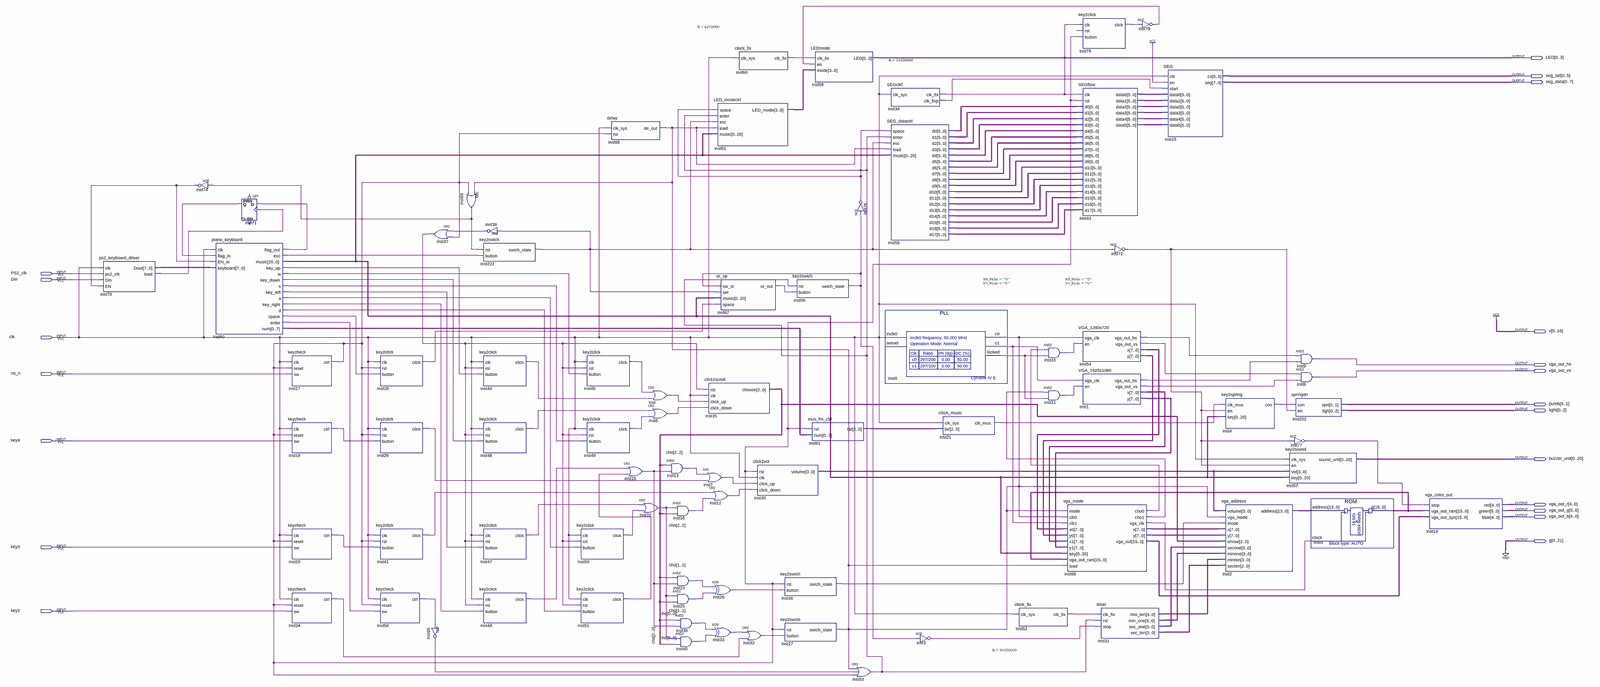
[diagram p0: schematic sheet, whole]
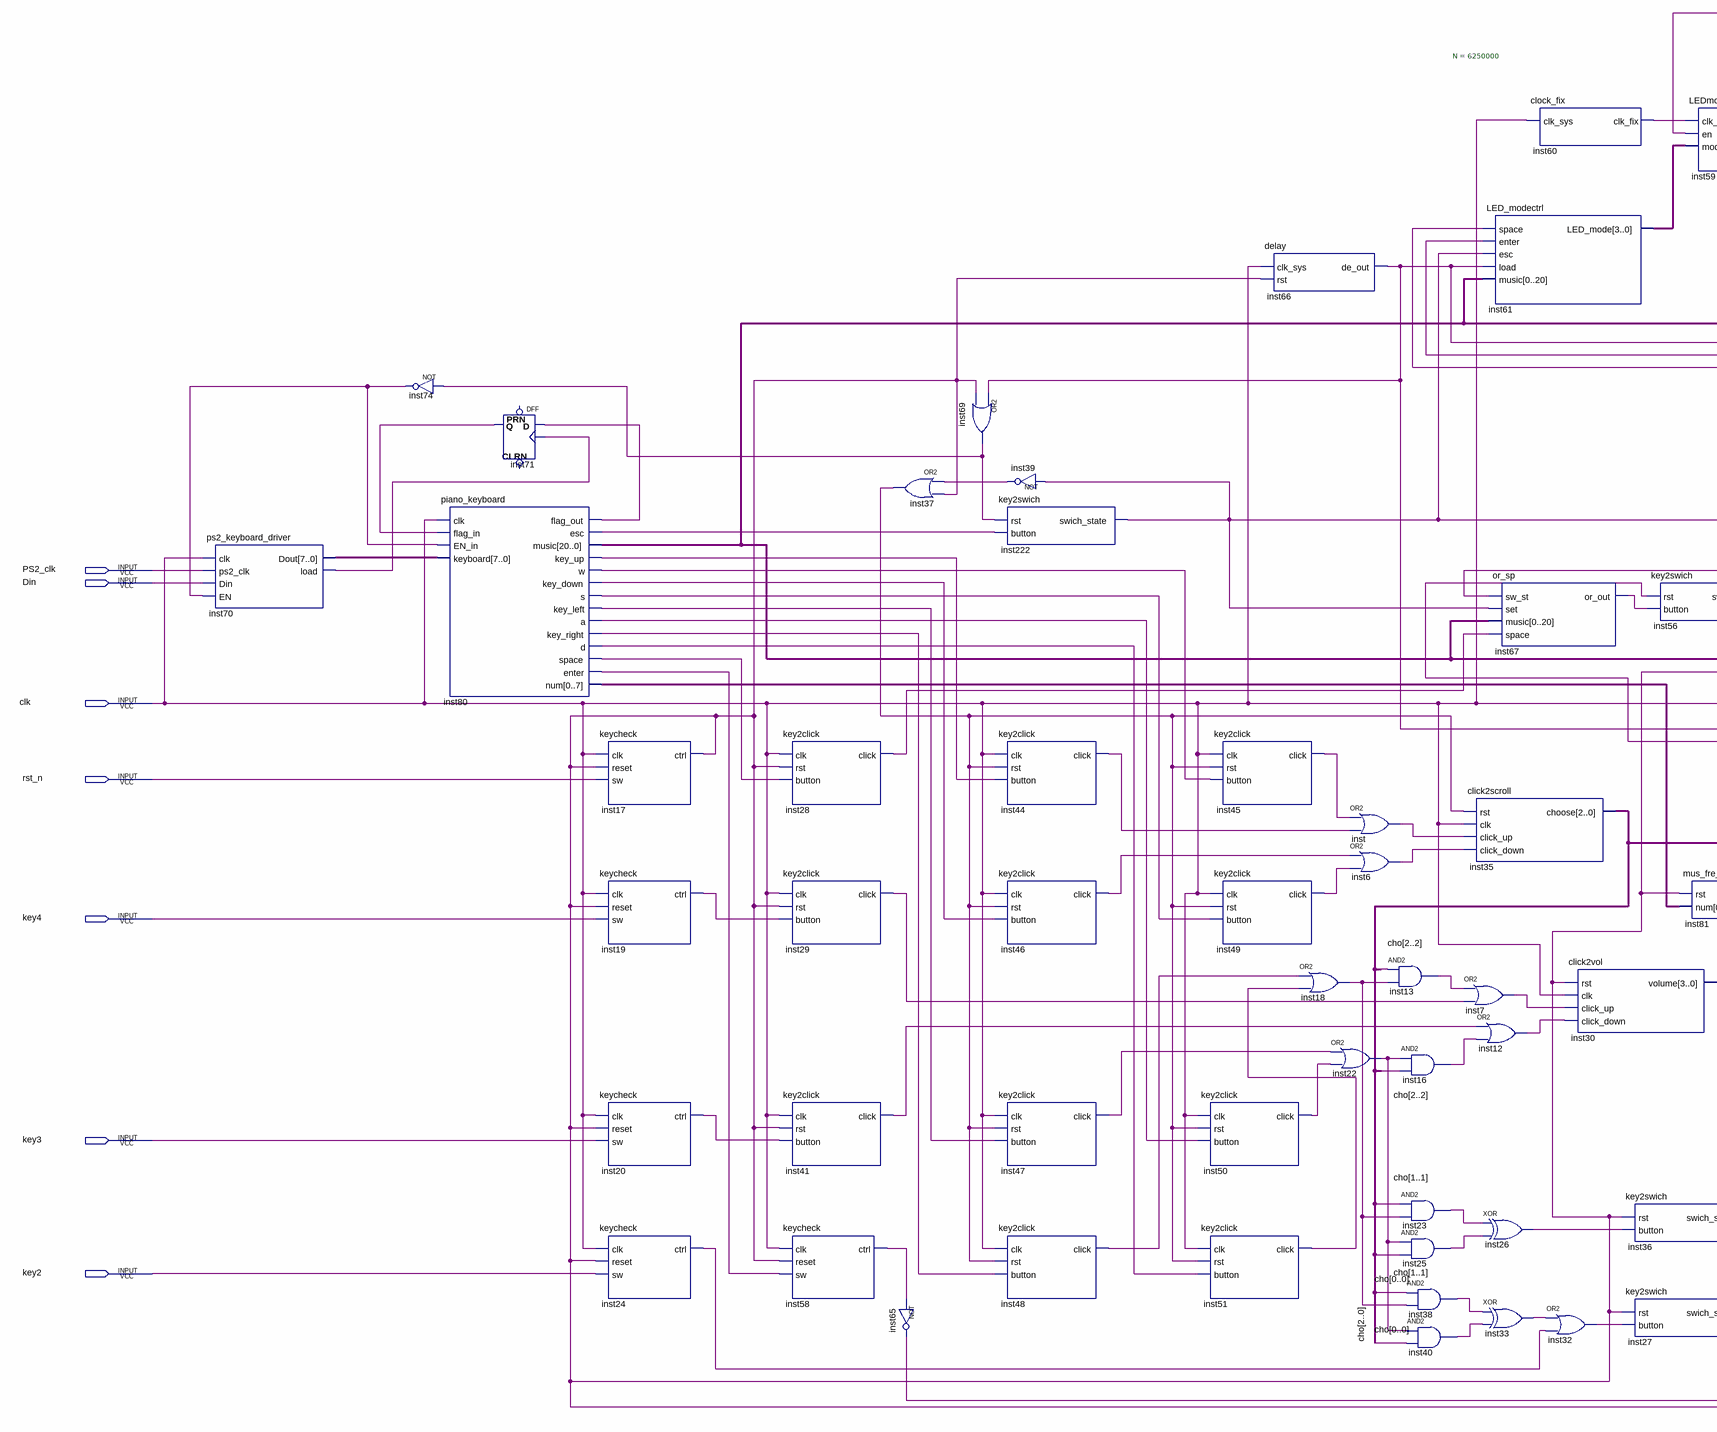
[diagram p1: schematic sheet, left part]
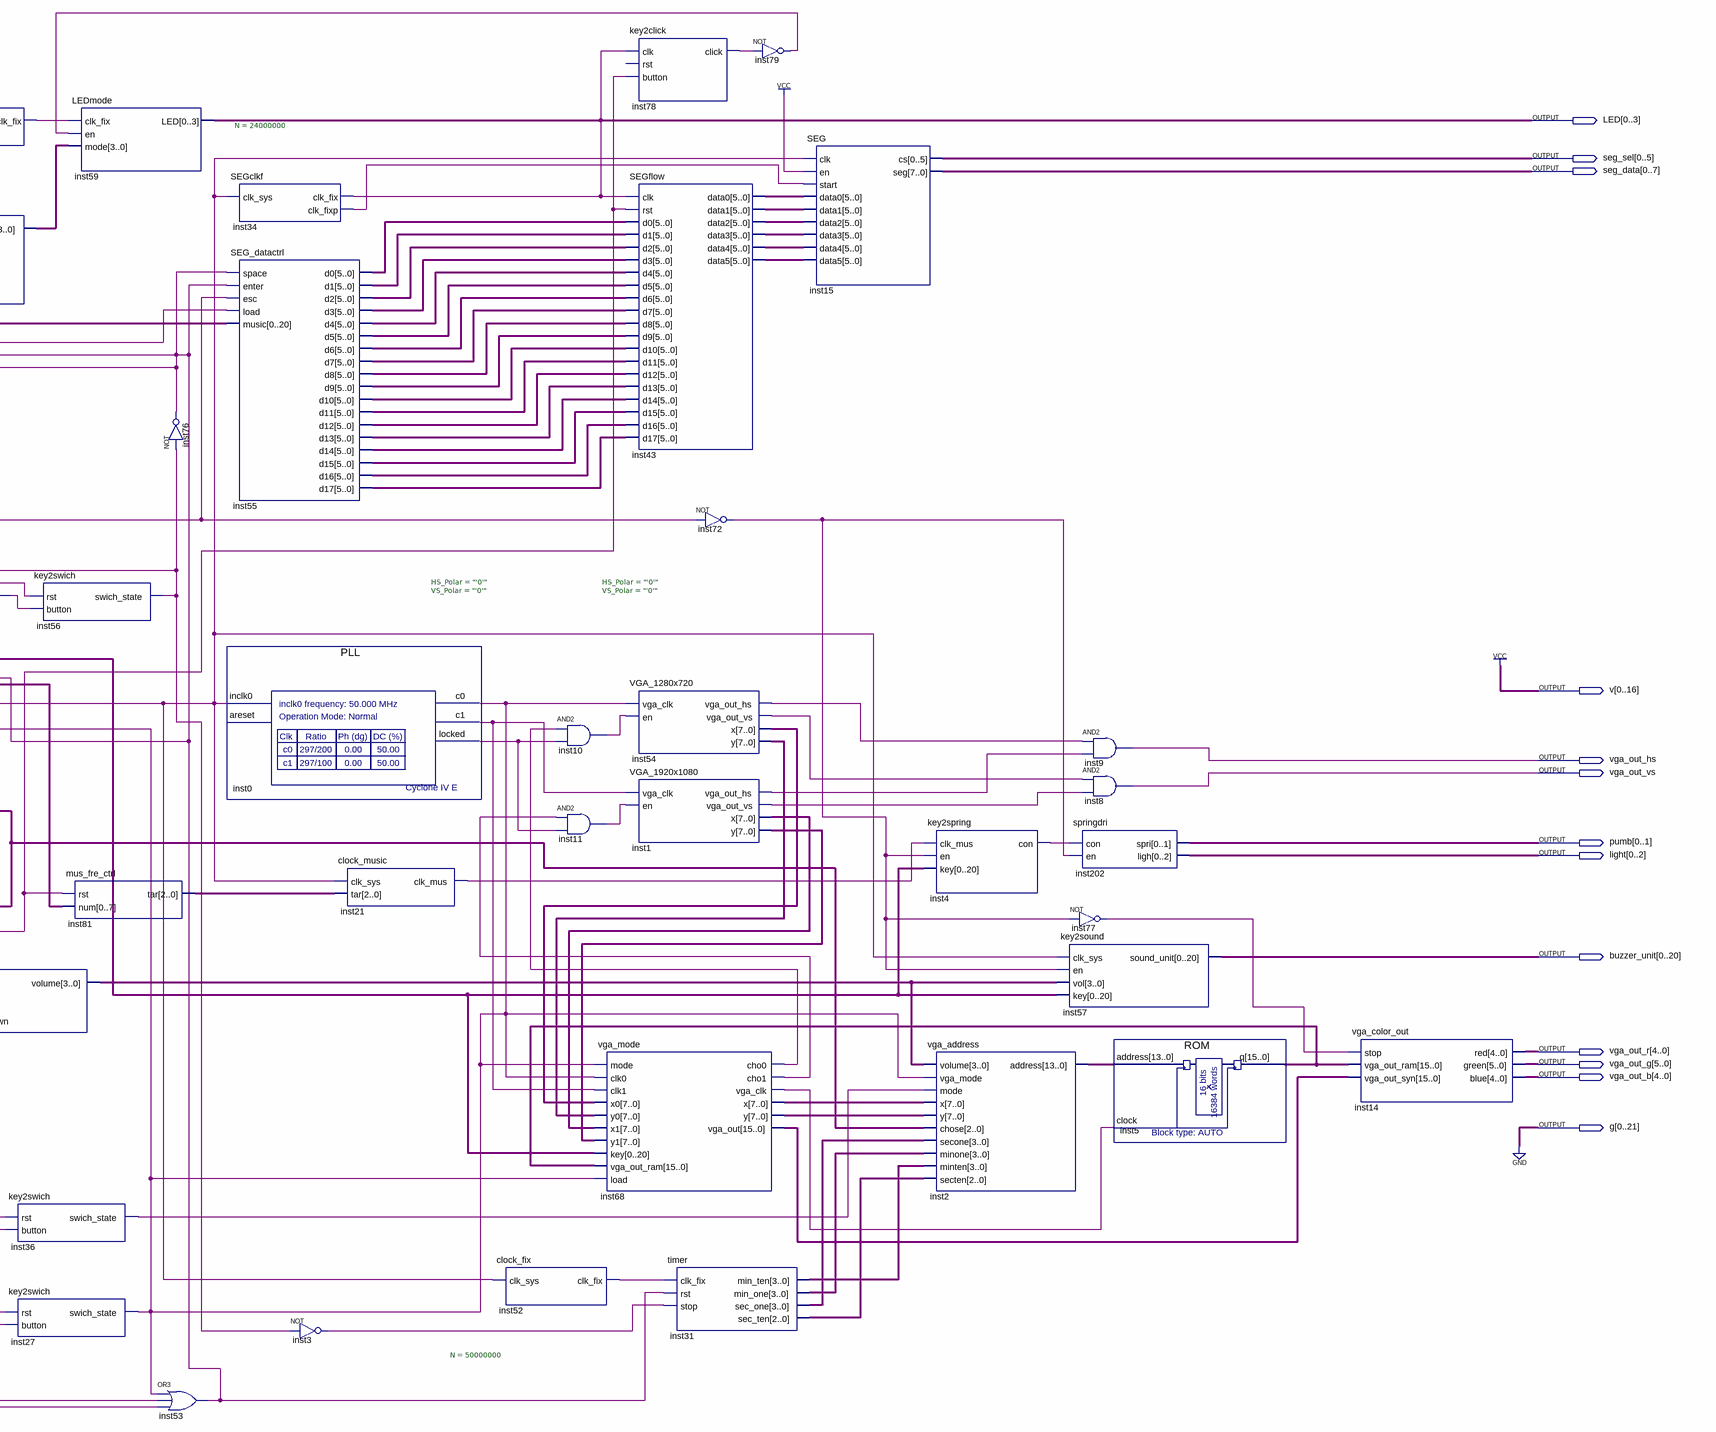
[diagram p2: schematic sheet, right part]
// Quartus schematic Eano.bdf as structural Verilog: 79 symbols, 20 pins
module Eano (
  input  PS2_clk,
  input  Din,
  input  clk,
  input  rst_n,
  input  key4,
  input  key3,
  input  key2,
  output [0:3] LED,
  output [0:5] seg_sel,
  output [0:7] seg_data,
  output [0:16] v,
  output vga_out_hs,
  output vga_out_vs,
  output [0:1] pumb,
  output [0:2] light,
  output [0:20] buzzer_unit,
  output [4:0] vga_out_r,
  output [5:0] vga_out_g,
  output [4:0] vga_out_b,
  output [0:21] g
);

  wire inst0_c1, inst0_locked, inst1_vga_out_hs, inst1_vga_out_vs, inst3_out, inst4_con, inst6_out,
       inst7_out, inst10_out, inst11_out, inst12_out, inst13_out, inst16_out, inst17_ctrl, inst18_out,
       inst19_ctrl, inst20_ctrl, inst21_clk_mus, inst22_out, inst23_out, inst24_ctrl, inst25_out, inst26_out,
       inst28_click, inst29_click, inst32_out, inst33_out, inst34_clk_fix, inst34_clk_fixp,
       inst36_swich_state, inst37_out, inst38_out, inst39_out, inst40_out, inst41_click, inst44_click,
       inst45_click, inst46_click, inst47_click, inst48_click, inst49_click, inst50_click, inst51_click,
       inst52_clk_fix, inst54_vga_out_hs, inst54_vga_out_vs, inst56_swich_state, inst58_ctrl, inst60_clk_fix,
       inst65_out, inst66_de_out, inst67_or_out, inst68_cho0, inst68_cho1, inst68_vga_clk, inst69_out,
       inst70_load, inst71_q, inst72_out, inst74_out, inst76_out, inst77_out, inst78_click, inst79_out,
       inst80_a, inst80_d, inst80_enter, inst80_esc, inst80_flag_out, inst80_key_down, inst80_key_left,
       inst80_key_right, inst80_key_up, inst80_s, inst80_space, inst80_w, inst222_swich_state, inst_out;
  wire [2:0] cho, inst31_sec_ten, inst81_tar;
  wire [3:0] inst30_volume, inst31_min_one, inst31_min_ten, inst31_sec_one, inst61_led_mode;
  wire [5:0] inst43_data0, inst43_data1, inst43_data2, inst43_data3, inst43_data4, inst43_data5, inst55_d0,
       inst55_d1, inst55_d2, inst55_d3, inst55_d4, inst55_d5, inst55_d6, inst55_d7, inst55_d8, inst55_d9,
       inst55_d10, inst55_d11, inst55_d12, inst55_d13, inst55_d14, inst55_d15, inst55_d16, inst55_d17;
  wire [7:0] inst1_x, inst1_y, inst54_x, inst54_y, inst68_x, inst68_y, inst70_dout, inst80_num;
  wire [13:0] inst2_address;
  wire [15:0] inst5_q, inst68_vga_out;
  wire [20:0] inst80_music;

  ps2_keyboard_driver inst70 (
    .clk(clk), .ps2_clk(PS2_clk), .Din(Din), .EN(inst74_out), .Dout(inst70_dout), .load(inst70_load));
  not inst74 (inst74_out, inst69_out);
  piano_keyboard inst80 (
    .clk(clk), .flag_in(inst71_q), .EN_in(inst74_out), .keyboard(inst70_dout), .flag_out(inst80_flag_out),
    .esc(inst80_esc), .music(inst80_music), .key_up(inst80_key_up), .w(inst80_w), .key_down(inst80_key_down),
    .s(inst80_s), .key_left(inst80_key_left), .a(inst80_a), .key_right(inst80_key_right), .d(inst80_d),
    .space(inst80_space), .enter(inst80_enter), .num(inst80_num));
  DFF inst71 (.CLK(inst70_load), .D(inst80_flag_out), .Q(inst71_q));  // open: CLRN, PRN
  keycheck inst17 (.clk(clk), .reset(inst17_ctrl), .sw(rst_n), .ctrl(inst17_ctrl));
  keycheck inst19 (.clk(clk), .reset(inst17_ctrl), .sw(key4), .ctrl(inst19_ctrl));
  keycheck inst20 (.clk(clk), .reset(inst17_ctrl), .sw(key3), .ctrl(inst20_ctrl));
  keycheck inst24 (.clk(clk), .reset(inst17_ctrl), .sw(key2), .ctrl(inst24_ctrl));
  key2click inst28 (.clk(clk), .rst(inst17_ctrl), .button(inst80_space), .click(inst28_click));
  key2click inst29 (.clk(clk), .rst(inst17_ctrl), .button(inst19_ctrl), .click(inst29_click));
  key2click inst41 (.clk(clk), .rst(inst17_ctrl), .button(inst20_ctrl), .click(inst41_click));
  keycheck inst58 (.clk(clk), .reset(inst17_ctrl), .sw(inst80_enter), .ctrl(inst58_ctrl));
  or inst37 (inst37_out, inst39_out, inst17_ctrl);
  not inst65 (inst65_out, inst58_ctrl);
  or inst69 (inst69_out, inst66_de_out, inst17_ctrl);
  key2swich inst222 (.rst(inst69_out), .button(inst80_esc), .swich_state(inst222_swich_state));
  key2click inst44 (.clk(clk), .rst(inst37_out), .button(inst80_key_up), .click(inst44_click));
  key2click inst46 (.clk(clk), .rst(inst37_out), .button(inst80_key_down), .click(inst46_click));
  key2click inst47 (.clk(clk), .rst(inst37_out), .button(inst80_key_left), .click(inst47_click));
  key2click inst48 (.clk(clk), .rst(inst37_out), .button(inst80_key_right), .click(inst48_click));
  not inst39 (inst39_out, inst222_swich_state);
  key2click inst50 (.clk(clk), .rst(inst37_out), .button(inst80_a), .click(inst50_click));
  key2click inst51 (.clk(clk), .rst(inst37_out), .button(inst80_d), .click(inst51_click));
  key2click inst45 (.clk(clk), .rst(inst37_out), .button(inst80_w), .click(inst45_click));
  key2click inst49 (.clk(clk), .rst(inst37_out), .button(inst80_s), .click(inst49_click));
  delay inst66 (.clk_sys(clk), .rst(inst17_ctrl), .de_out(inst66_de_out));
  or inst18 (inst18_out, inst48_click, inst51_click);
  or inst (inst_out, inst45_click, inst44_click);
  or inst6 (inst6_out, inst46_click, inst49_click);
  or inst22 (inst22_out, inst47_click, inst50_click);
  and inst13 (inst13_out, cho[2], inst18_out);
  and inst16 (inst16_out, inst22_out, cho[2]);
  and inst23 (inst23_out, cho[1], inst18_out);
  and inst25 (inst25_out, inst22_out, cho[1]);
  and inst38 (inst38_out, cho[0], inst18_out);
  and inst40 (inst40_out, inst22_out, cho[0]);
  LED_modectrl inst61 (
    .space(inst76_out), .enter(inst76_out), .esc(inst222_swich_state), .load(inst66_de_out),
    .music(inst80_music), .LED_mode(inst61_led_mode));
  or_sp inst67 (
    .sw_st(inst56_swich_state), .set(inst222_swich_state), .music(inst80_music), .space(inst28_click),
    .or_out(inst67_or_out));
  click2scroll inst35 (.rst(inst37_out), .clk(clk), .click_up(inst_out), .click_down(inst6_out), .choose(cho));
  or inst7 (inst7_out, inst13_out, inst29_click);
  or inst12 (inst12_out, inst41_click, inst16_out);
  xor inst26 (inst26_out, inst23_out, inst25_out);
  xor inst33 (inst33_out, inst38_out, inst40_out);
  clock_fix #(.N(6250000)) inst60 (.clk_sys(clk), .clk_fix(inst60_clk_fix));
  or inst32 (inst32_out, inst33_out, inst24_ctrl);
  click2vol inst30 (
    .rst(inst17_ctrl), .clk(clk), .click_up(inst7_out), .click_down(inst12_out), .volume(inst30_volume));
  key2swich inst56 (.rst(inst76_out), .button(inst67_or_out), .swich_state(inst56_swich_state));
  key2swich inst36 (.rst(inst17_ctrl), .button(inst26_out), .swich_state(inst36_swich_state));
  key2swich inst27 (.rst(inst17_ctrl), .button(inst32_out), .swich_state(inst66_de_out));
  LEDmode inst59 (.clk_fix(inst60_clk_fix), .en(inst79_out), .mode(inst61_led_mode), .LED(LED));
  mus_fre_ctrl inst81 (.rst(inst17_ctrl), .num(inst80_num), .tar(inst81_tar));
  not inst76 (inst76_out, inst56_swich_state);
  or inst53 (inst76_out, inst66_de_out, inst65_out, inst17_ctrl);
  SEGclkf #(.N(24000000)) inst34 (.clk_sys(clk), .clk_fix(inst34_clk_fix), .clk_fixp(inst34_clk_fixp));
  SEG_datactrl inst55 (
    .space(inst76_out), .enter(inst76_out), .esc(inst222_swich_state), .load(inst66_de_out),
    .music(inst80_music), .d0(inst55_d0), .d1(inst55_d1), .d2(inst55_d2), .d3(inst55_d3), .d4(inst55_d4),
    .d5(inst55_d5), .d6(inst55_d6), .d7(inst55_d7), .d8(inst55_d8), .d9(inst55_d9), .d10(inst55_d10),
    .d11(inst55_d11), .d12(inst55_d12), .d13(inst55_d13), .d14(inst55_d14), .d15(inst55_d15),
    .d16(inst55_d16), .d17(inst55_d17));
  PLL inst0 (.inclk0(clk), .c0(inst66_de_out), .c1(inst0_c1), .locked(inst0_locked));  // open: areset
  not inst3 (inst3_out, inst56_swich_state);
  clock_music inst21 (.clk_sys(clk), .tar(inst81_tar), .clk_mus(inst21_clk_mus));
  clock_fix #(.N(50000000)) inst52 (.clk_sys(clk), .clk_fix(inst52_clk_fix));
  and inst10 (inst10_out, inst68_cho0, inst0_locked);
  and inst11 (inst11_out, inst68_cho1, inst0_locked);
  vga_mode inst68 (
    .mode(inst66_de_out), .clk0(inst66_de_out), .clk1(inst0_c1), .x0(inst54_x), .y0(inst54_y), .x1(inst1_x),
    .y1(inst1_y), .key(inst80_music), .vga_out_ram(inst5_q), .load(inst66_de_out), .cho0(inst68_cho0),
    .cho1(inst68_cho1), .vga_clk(inst68_vga_clk), .x(inst68_x), .y(inst68_y), .vga_out(inst68_vga_out));
  key2click inst78 (.clk(inst34_clk_fix), .button(inst17_ctrl), .click(inst78_click));  // open: rst
  SEGflow inst43 (
    .clk(inst34_clk_fix), .rst(inst17_ctrl), .d0(inst55_d0), .d1(inst55_d1), .d2(inst55_d2), .d3(inst55_d3),
    .d4(inst55_d4), .d5(inst55_d5), .d6(inst55_d6), .d7(inst55_d7), .d8(inst55_d8), .d9(inst55_d9),
    .d10(inst55_d10), .d11(inst55_d11), .d12(inst55_d12), .d13(inst55_d13), .d14(inst55_d14),
    .d15(inst55_d15), .d16(inst55_d16), .d17(inst55_d17), .data0(inst43_data0), .data1(inst43_data1),
    .data2(inst43_data2), .data3(inst43_data3), .data4(inst43_data4), .data5(inst43_data5));
  VGA_1280x720 #(.HS_Polar("'0'"), .VS_Polar("'0'")) inst54 (
    .vga_clk(inst66_de_out), .en(inst10_out), .vga_out_hs(inst54_vga_out_hs), .vga_out_vs(inst54_vga_out_vs),
    .x(inst54_x), .y(inst54_y));
  VGA_1920x1080 #(.HS_Polar("'0'"), .VS_Polar("'0'")) inst1 (
    .vga_clk(inst0_c1), .en(inst11_out), .vga_out_hs(inst1_vga_out_hs), .vga_out_vs(inst1_vga_out_vs),
    .x(inst1_x), .y(inst1_y));
  not inst72 (inst72_out, inst222_swich_state);
  timer inst31 (
    .clk_fix(inst52_clk_fix), .rst(inst76_out), .stop(inst3_out), .min_ten(inst31_min_ten),
    .min_one(inst31_min_one), .sec_one(inst31_sec_one), .sec_ten(inst31_sec_ten));
  not inst79 (inst79_out, inst78_click);
  SEG inst15 (
    .clk(clk), .en(1'b1), .start(inst34_clk_fixp), .data0(inst43_data0), .data1(inst43_data1),
    .data2(inst43_data2), .data3(inst43_data3), .data4(inst43_data4), .data5(inst43_data5), .cs(seg_sel),
    .seg(seg_data));
  key2spring inst4 (.clk_mus(inst21_clk_mus), .en(inst72_out), .key(inst80_music), .con(inst4_con));
  vga_address inst2 (
    .volume(inst30_volume), .vga_mode(inst66_de_out), .mode(inst36_swich_state), .x(inst68_x), .y(inst68_y),
    .chose(cho), .secone(inst31_sec_one), .minone(inst31_min_one), .minten(inst31_min_ten),
    .secten(inst31_sec_ten), .address(inst2_address));
  key2sound inst57 (.clk_sys(clk), .en(inst72_out), .vol(inst30_volume), .key(inst80_music), .sound_unit(buzzer_unit));
  and inst9 (vga_out_hs, inst54_vga_out_hs, inst1_vga_out_hs);
  and inst8 (vga_out_vs, inst54_vga_out_vs, inst1_vga_out_vs);
  springdri inst202 (.con(inst4_con), .en(inst72_out), .spri(pumb), .ligh(light));
  not inst77 (inst77_out, inst72_out);
  ROM inst5 (.address(inst2_address), .clock(inst68_vga_clk), .q(inst5_q));
  vga_color_out inst14 (
    .stop(inst77_out), .vga_out_ram(inst5_q), .vga_out_syn(inst68_vga_out), .red(vga_out_r),
    .green(vga_out_g), .blue(vga_out_b));

  assign g = {22{1'b0}};
  assign v = {17{1'b1}};
endmodule
